# EAGLE schematic micro-quad-1.0 (EAGLE 7.5.0)
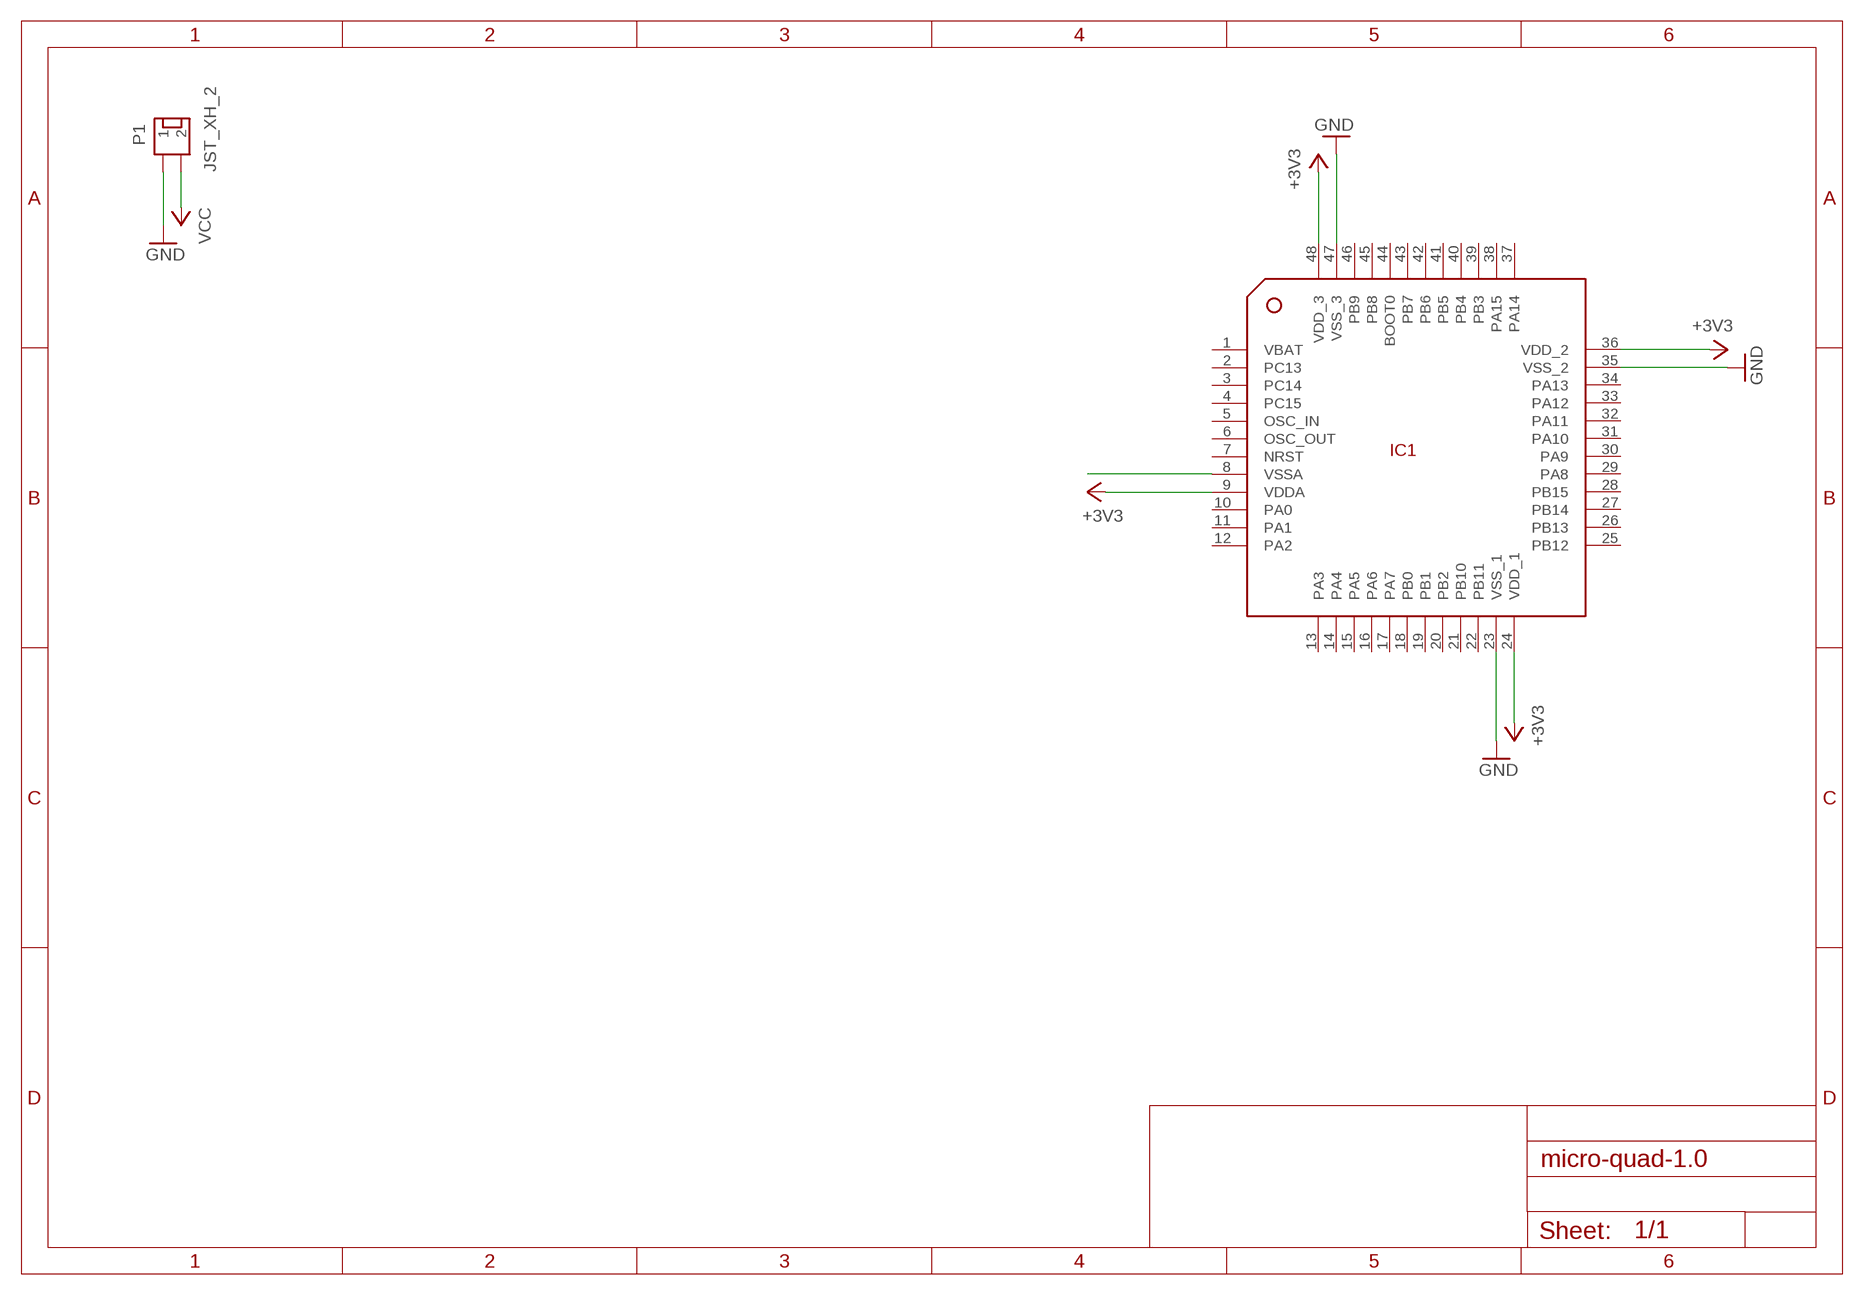
[diagram p0: schematic, sheet 1]

## Parts
IC1  STM32F103C8T6  [TQFP48]
P1  JST_XH_2  [JST_XH_02]

## Nets
+3V3: IC1.9(VDDA) IC1.24(VDD_1) IC1.36(VDD_2) IC1.48(VDD_3)
GND: IC1.23(VSS_1) IC1.35(VSS_2) IC1.47(VSS_3) P1.1
N$1: IC1.8(VSSA)
VCC: P1.2
Unconnected: IC1.2(PC13) IC1.3(PC14) IC1.4(PC15) IC1.5(OSC_IN) IC1.6(OSC_OUT) IC1.7(NRST) IC1.10(PA0) IC1.11(PA1) IC1.12(PA2) IC1.13(PA3) IC1.14(PA4) IC1.15(PA5) IC1.16(PA6) IC1.17(PA7) IC1.18(PB0) IC1.19(PB1) IC1.20(PB2) IC1.21(PB10) IC1.22(PB11) IC1.25(PB12) IC1.26(PB13) IC1.27(PB14) IC1.28(PB15) IC1.29(PA8) IC1.30(PA9) IC1.31(PA10) IC1.32(PA11) IC1.33(PA12) IC1.34(PA13) IC1.37(PA14) IC1.38(PA15) IC1.39(PB3) IC1.40(PB4) IC1.41(PB5) IC1.42(PB6) IC1.43(PB7) IC1.44(BOOT0) IC1.45(PB8) IC1.46(PB9)

## Power pins joined to a net without a drawn wire
VBAT: IC1.1(VBAT)

## Library data of the parts
IC1 = stm32:STM32F103C8T6
P1 = con-jst:JST_XH_2